# EAGLE design 4093 dual osc (EAGLE 9.6.0)
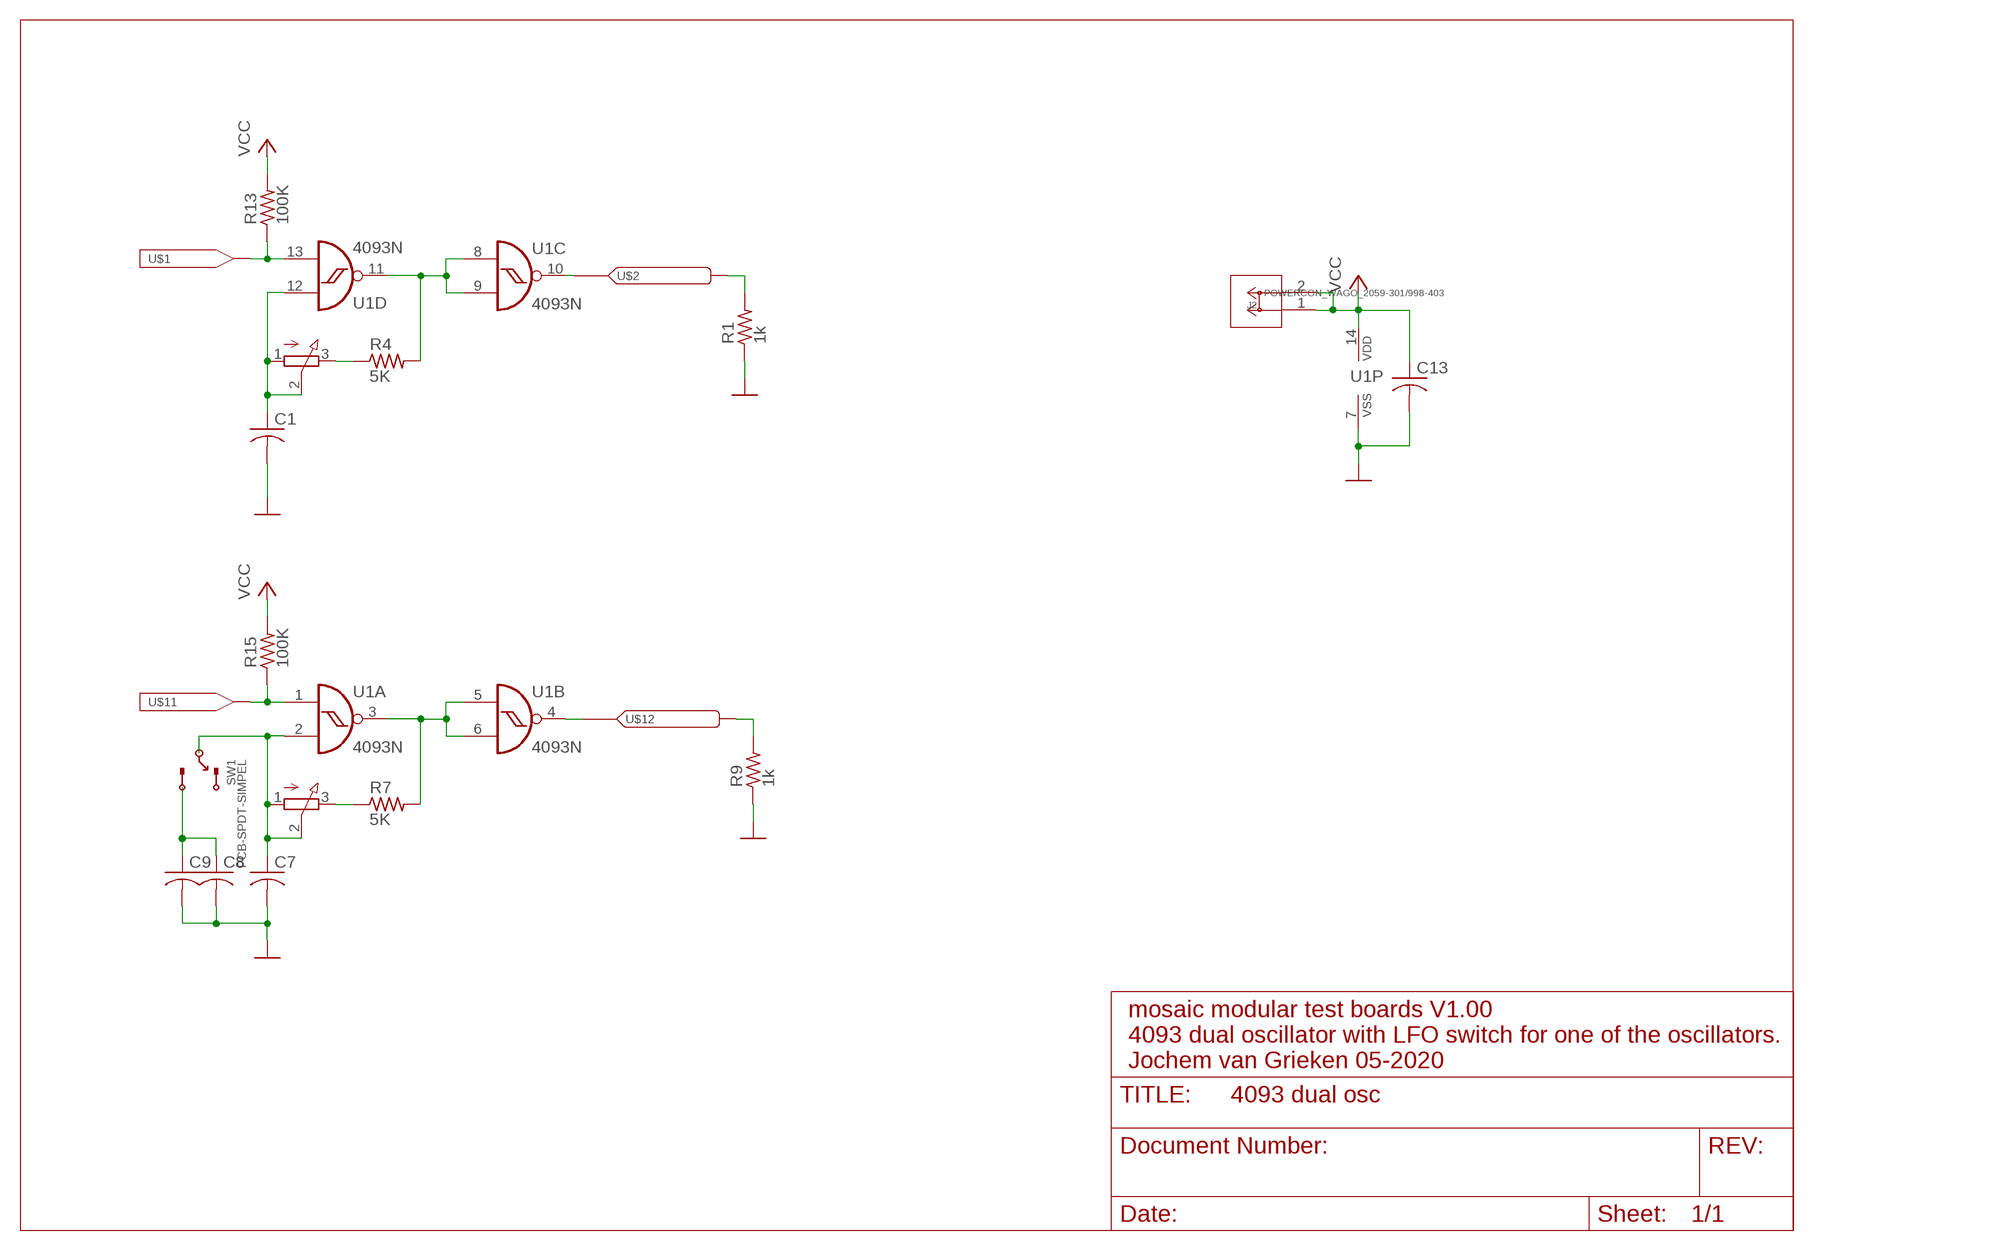
[diagram p0: schematic, sheet 1]

## Parts
1  ALPHA-16MM-UNDERSIDESMD  [ALPHA-16MMPOT-UNDERSIDE-SLOT-SMDPADS]
3  ALPHA-16MM-UNDERSIDESMD  [ALPHA-16MMPOT-UNDERSIDE-SLOT-SMDPADS]
C1  C-USC0805  [C0805]
C7  C-USC0805  [C0805]
C8  C-USC0805  [C0805]
C9  C-USC0805  [C0805]
C13  C-USC0805  [C0805]
J2  POWERCON_WAGO_2059-301/998-403  [CONN_2059-301/998-403_2]
R1  1k  R-US_R0805  [R0805]
R4  5K  R-US_R0805  [R0805]
R7  5K  R-US_R0805  [R0805]
R9  1k  R-US_R0805  [R0805]
R13  100K  R-US_R0805  [R0805]
R15  100K  R-US_R0805  [R0805]
SW1  PCB-SPDT-SIMPEL  [SPDT-SLIDE]
U1  4093N  [DIL14]
U$1  IN  [BANANA_NOLED]
U$2  OUT  [BANANA_LED]
U$11  IN  [BANANA_NOLED]
U$12  OUT  [BANANA_LED]

## Nets
GND: C1.2 C7.2 C8.2 C9.2 C13.2 R1.1 R9.1 U1.7(P:VSS)
N$1: R1.2 U$2.OUTERRING U$2.OUTERRING2
N$4: C8.1 C9.1 SW1.3
N$5: U1.10(C:O) U$2.>NAME U$2.INNERRING U$2.INNERRING2
N$6: U1.4(B:O) U$12.>NAME U$12.INNERRING U$12.INNERRING2
N$10: 1.3 R4.1
N$11: 1.1 1.2 C1.1 U1.12(D:I0)
N$14: R13.1 U1.13(D:I1) U$1.P$1
N$16: R4.2 U1.8(C:I0) U1.9(C:I1) U1.11(D:O)
N$23: 3.3 R7.1
N$24: 3.1 3.2 C7.1 SW1.2 U1.2(A:I1)
N$27: R15.1 U1.1(A:I0) U$11.P$1
N$28: R7.2 U1.3(A:O) U1.5(B:I0) U1.6(B:I1)
N$30: R9.2 U$12.OUTERRING U$12.OUTERRING2
VCC: C13.1 J2.1 J2.2 R13.2 R15.2 U1.14(P:VDD)
Unconnected: SW1.1

## Notes on the sheet
- mosaic modular test boards V1.00
  4093 dual oscillator with LFO switch for one of the oscillators.
  Jochem van Grieken 05-2020

## Library data of the parts
1 3 = mosaic modular system:ALPHA-16MM-UNDERSIDE: 16mm alpha pcb mount potentiometer mounted through the board with SMD pads on the bottom to solder to.
C1 C7-C9 C13 = rcl:C-US: CAPACITOR, American symbol; SPICEPREFIX: C
J2 = mosaic modular system:POWERCON_WAGO_2059-301/998-403; BUILT_BY: EMA_Kyle; COPYRIGHT: Copyright (C) 2018 Accelerated Designs. All rights reserved; MANUFACTURER_PART_NUMBER: 2059-301/998-403; VENDOR: Wago
R1 R4 R7 R9 R13 R15 = rcl:R-US_: RESISTOR, American symbol; SPICEPREFIX: R
SW1 = mosaic modular system:PCB-SPDT-SIMPEL
U1 = 40xx:4093: Quad 2-input NAND schmitt trigger
U$1 U$11 = mosaic modular system:IN
U$2 U$12 = mosaic modular system:OUT: output with leds reverse mounted on the bottom layer. Works with simple banana sockets with all the plastics removed.

## Board
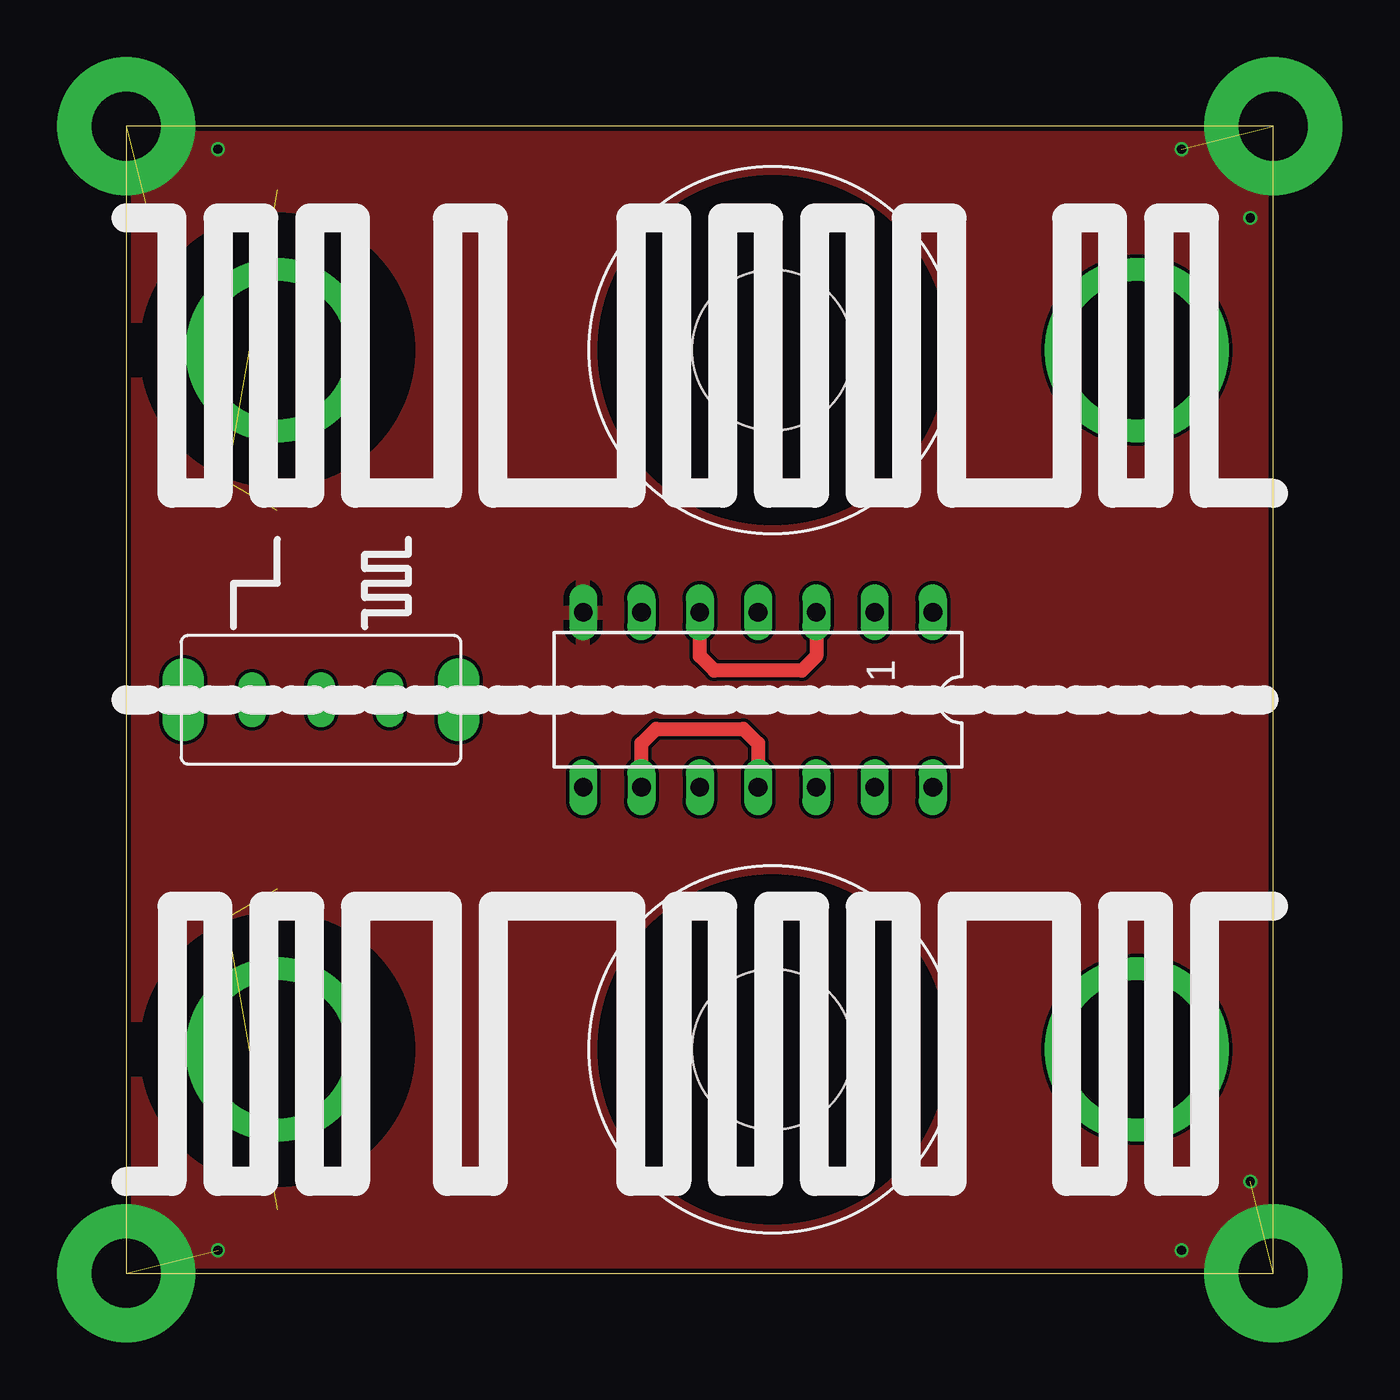
[diagram p1: board, top side]
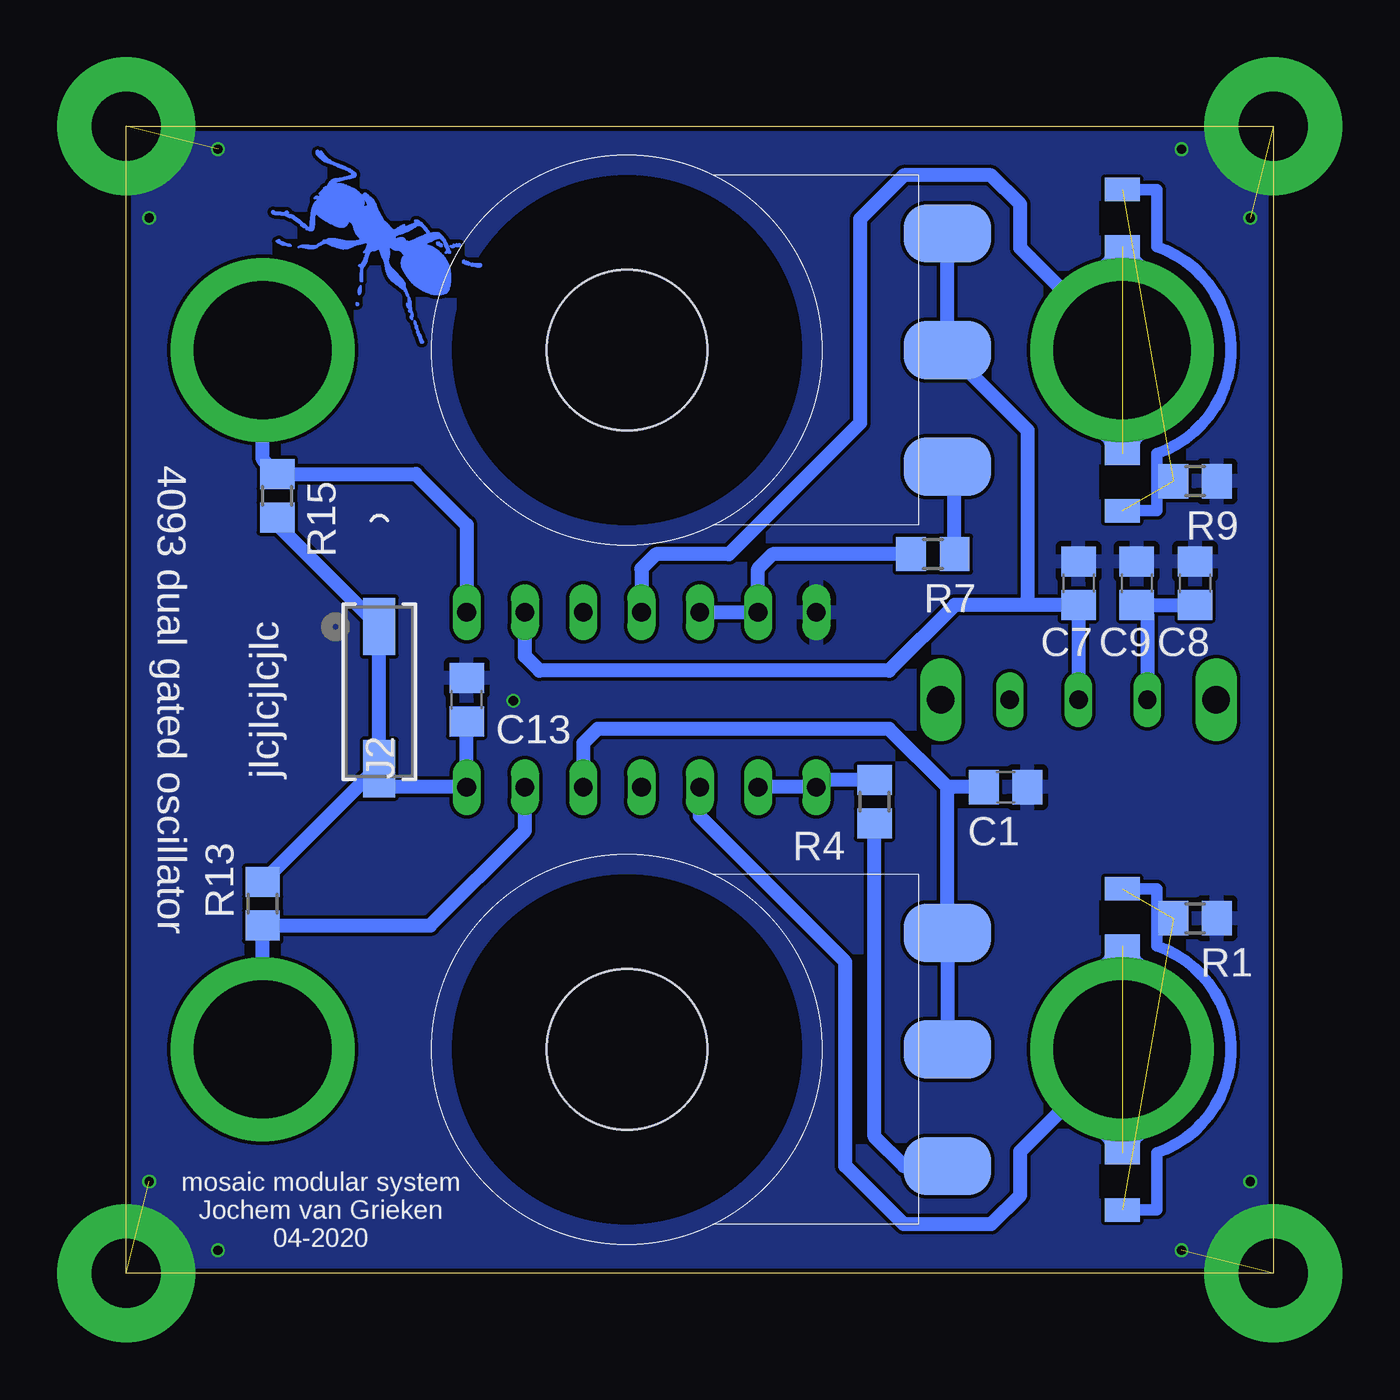
[diagram p2: board, bottom side, seen from below]

Size 50 x 50 mm. Coordinates in mm from the lower left corner, seen from the top.
Outline: 50,50 0,50 0,0 50,0 50,50
Copper layers (1*16): Top 0.035559375mm / dielectric 1.6mm / Bottom 0.035559375mm
Design rules "jlcpcb2layer": minimum track width 5mil, minimum drill 12mil, track to track 6mil, track to pad 6mil, pad to pad 6mil, via to via 6mil, smd to smd 6mil, copper to edge 8mil, drill to drill 6mil, minimum pad ring 5mil, minimum via ring 3mil, stop-mask expansion 2.5mil, vias tented up to drill 0mil, thermal gap 10mil

### Footprints (pad centres in the part's own frame; a part is rotated, then mirrored left to right if it is on the bottom)
ALPHA-16MMPOT-UNDERSIDE-SLOT-SMDPADS = smd 2.54 x 3.81 bottom: 1 -5.08,-13.97; 2 0,-13.97; 3 5.08,-13.97 | hole 7: 0,0
C0805 = smd 1.3 x 1.5: 1 -0.95,0; 2 0.95,0
CONN_2059-301/998-403_2 = smd 2.489 x 1.397: 1 -5.702,0; 2 0.498,0
R0805 = smd 1.3 x 1.5: 1 -0.95,0; 2 0.95,0
SPDT-SLIDE = drill 0.8 long: 1 -3,0; 2 0,0; 3 3,0 | drill 1.2 pad 1.676 long: TAB1 -6,0; TAB2 6,0
DIL14 = drill 0.813 long: 1 -7.62,-3.81; 2 -5.08,-3.81; 3 -2.54,-3.81; 4 0,-3.81; 5 2.54,-3.81; 6 5.08,-3.81; 7 7.62,-3.81; 8 7.62,3.81; 9 5.08,3.81; 10 2.54,3.81; 11 0,3.81; 12 -2.54,3.81; 13 -5.08,3.81; 14 -7.62,3.81
BANANA_NOLED = drill 6 pad 8: P$1 0,0
BANANA_LED = drill 6 pad 8: >NAME 0,0 | smd 1.016 x 1.524 bottom: INNERRING -4.5,0; INNERRING2 4.5,0; OUTERRING -7,0; OUTERRING2 7,0

### Placement (x,y rotation side)
1  28.18,9.76 270 top
3  28.18,40.24 270 top
C1  11.66,21.19 0 bottom
C7  8.49,30.08 90 bottom
C8  3.41,30.08 90 bottom
C9  5.95,30.08 90 bottom
C13  35.16,25 90 bottom
J2  38.97,22.49 270 bottom
R1  3.41,15.47 180 bottom
R4  17.38,20.55 90 bottom
R7  14.84,31.35 180 bottom
R9  3.41,34.52 180 bottom
R13  44.05,16.11 90 bottom
R15  43.41,33.89 270 bottom
SW1  8.49,25 180 top
U1  27.54,25 180 top
U$1  44.05,9.76 180 top
U$2  6.59,9.76 90 top
U$3  [ANT_LOGO_COPPER_BOTTOM]  39,45 0 top
U$11  44.05,40.24 180 top
U$12  6.59,40.24 90 top

### Tracks (layer width: path | path; a pad name or v marks a point on that pad's centre or on a via)
GND  (via drill 0.4, 3 pad 6)  (4 unrouted)
  other vias: 50,0 50,50 0,50 0,0 49,46 46,49 4,49 1,46 1,4 4,1 46,1 49,4 33.12,24.95
  pour Bottom: 50,0 0,0 0,50 50,50
  pour Top: 50,0 0,0 0,50 50,50
N$1  (2 unrouted)
N$4
  Bottom 0.61: SW1.3 5.49,28.67 C9.1 C8.1
N$5  (2 unrouted)
  Bottom 0.61: U$2.>NAME 11.03,5.32 11.03,3.41 12.3,2.14 16.11,2.14 18.65,4.68 18.65,13.57 25,19.92 U1.10
N$6  (2 unrouted)
  Bottom 0.61: U$12.>NAME 11.03,44.69 11.03,46.59 12.3,47.86 16.11,47.86 18.02,45.95 18.02,37.06 23.73,31.35 26.91,31.35 27.54,30.71 U1.4
N$10
  Bottom 0.61: 1.3 16.11,4.68 17.38,5.95 R4.1
N$11
  Bottom 0.61: 1.2 1.1 14.21,21.19 | U1.12 30.08,23.09 29.45,23.73 16.74,23.73 14.21,21.19 | C1.1 14.21,21.19
N$14
  Bottom 0.61: U$1.P$1 R13.1 36.74,15.16 32.62,19.29 U1.13
N$16
  Top 0.61: U1.9 22.46,23.09 23.09,23.73 26.91,23.73 27.54,23.09 U1.11
  Bottom 0.61: U1.9 U1.8 19.61,21.5 R4.2
N$23
  Bottom 0.61: R7.1 13.89,34.84 3.3
N$24
  Bottom 0.61: 3.1 3.2 10.71,36.74 10.71,29.13 | 10.71,29.13 C7.1 SW1.2 | U1.2 32.62,26.91 31.98,26.27 16.74,26.27 13.88,29.13 10.71,29.13
N$27
  Bottom 0.61: U$11.P$1 44.05,35.48 R15.1 37.38,34.84 35.16,32.62 U1.1
N$28
  Top 0.61: U1.3 30.08,26.91 29.45,26.27 25.64,26.27 25,26.91 U1.5
  Bottom 0.61: U1.5 U1.6 22.46,30.71 21.82,31.35 R7.2
N$30  (2 unrouted)
VCC
  Bottom 0.61: U1.14 35.16,21.5 | U1.14 C13.1 | U1.14 38.97,21.19 J2.2 | J2.2 J2.1 43.41,32.64 R15.2 | J2.2 39.12,21.99 R13.2

### Text on the board
bPlace: jlcjlcjlcjlc | 4093 dual gated oscillator | mosaic modular system / Jochem van Grieken / 04-2020